# Altium schematic sheet [11]-NAD.SchDoc: S32K1_CONTROLLER
size A3; SheetNumber: 11; SheetTotal: 11
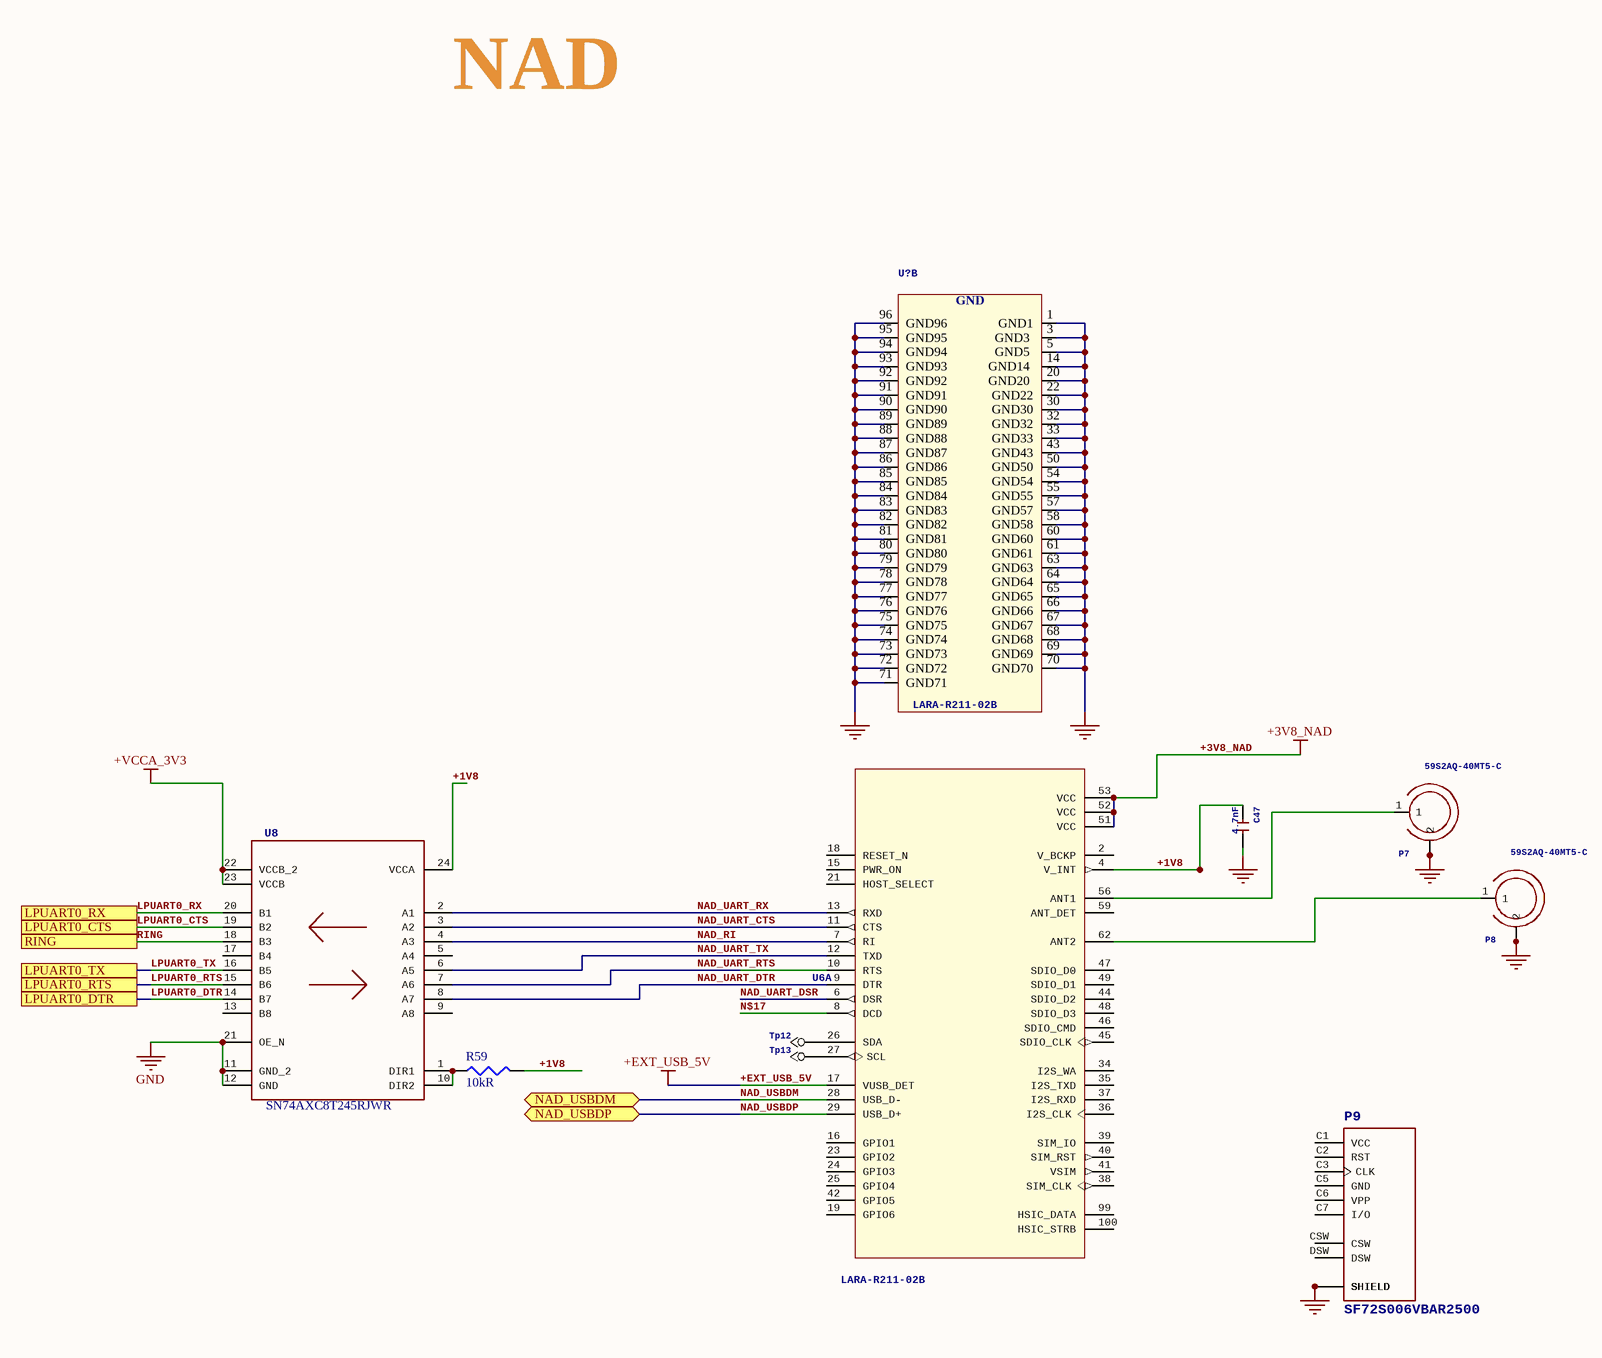
[diagram p0: [11]-NAD.SchDoc]

## Parts
C47  4.7nF  [C0402]
P7  59S2AQ-40MT5-C  [59S2AQ-40MT5-C]
P8  59S2AQ-40MT5-C  [59S2AQ-40MT5-C]
P9  SF72S006VBAR2500  [SF72S006VBAR2500_JAE_SF72S006VBAR2500]
R59  Resistance: 10kR  [RES0402]  (hidden comment: ERJ-2GEJ103X)
Tp12  TP  [TestPoint]  (value not drawn)
Tp13  TP  [TestPoint]  (value not drawn)
U6  LARA-R211-02B  [UBLOX_LARA-R211-02B]  (part A of 2)
U8  Value  [RJW0024A]  (value not drawn)
U?  LARA-R211-02B  [UBLOX_LARA-R211-02B]  (part B of 2)

## Ports
LPUART0_CTS, LPUART0_DTR, LPUART0_RTS, LPUART0_RX, LPUART0_TX, NAD_USBDM (bidir), NAD_USBDP (bidir), RING

## Nets
+3V8_NAD: U6.51(VCC) U6.52(VCC) U6.53(VCC)
+EXT_USB_5V: U6.17(VUSB_DET)
+VCCA_3V3: U8.22(VCCB_2) U8.23(VCCB)
GND: C47.2 P7.2_3_4_5_6_7_8_9(2) P7.3 P7.4 P7.5 P7.6 P7.7 P7.8 P8.2_3_4_5_6_7_8_9(2) P8.3 P8.4 P8.5 P8.6 P8.7 P8.8 P9.G1(SHIELD) P9.G2(SHIELD) P9.G3(SHIELD) P9.G4(SHIELD) P9.G5(SHIELD) P9.G6(SHIELD) P9.G7(SHIELD) P9.G8(SHIELD) P9.G9(SHIELD) P9.G10(SHIELD) U8.11(GND_2) U8.12(GND) U8.21(OE_N) U?.1(GND1) U?.3(GND3) U?.5(GND5) U?.14(GND14) U?.20(GND20) U?.22(GND22) U?.30(GND30) U?.32(GND32) U?.33(GND33) U?.43(GND43) U?.50(GND50) U?.54(GND54) U?.55(GND55) U?.57(GND57) U?.58(GND58) U?.60(GND60) U?.61(GND61) U?.63(GND63) U?.64(GND64) U?.65(GND65) U?.66(GND66) U?.67(GND67) U?.68(GND68) U?.69(GND69) U?.70(GND70) U?.71(GND71) U?.72(GND72) U?.73(GND73) U?.74(GND74) U?.75(GND75) U?.76(GND76) U?.77(GND77) U?.78(GND78) U?.79(GND79) U?.80(GND80) U?.81(GND81) U?.82(GND82) U?.83(GND83) U?.84(GND84) U?.85(GND85) U?.86(GND86) U?.87(GND87) U?.88(GND88) U?.89(GND89) U?.90(GND90) U?.91(GND91) U?.92(GND92) U?.93(GND93) U?.94(GND94) U?.95(GND95) U?.96(GND96)
+1V8: C47.1 R59.2 U6.4(V_INT) U8.24(VCCA)
LPUART0_CTS: U8.19(B2) ; port LPUART0_CTS
LPUART0_DTR: U8.14(B7) ; port LPUART0_DTR
LPUART0_RTS: U8.15(B6) ; port LPUART0_RTS
LPUART0_RX: U8.20(B1) ; port LPUART0_RX
LPUART0_TX: U8.16(B5) ; port LPUART0_TX
N$17: U6.8(DCD)
NAD_RI: U6.7(RI) U8.4(A3)
NAD_UART_CTS: U6.11(CTS) U8.3(A2)
NAD_UART_DSR: U6.6(DSR)
NAD_UART_DTR: U6.9(DTR) U8.8(A7)
NAD_UART_RTS: U6.10(RTS) U8.7(A6)
NAD_UART_RX: U6.13(RXD) U8.2(A1)
NAD_UART_TX: U6.12(TXD) U8.6(A5)
NAD_USBDM: U6.28(USB_D-) ; port NAD_USBDM
NAD_USBDP: U6.29(USB_D+) ; port NAD_USBDP
RING: U8.18(B3) ; port RING
NetP7_1: P7.1 U6.56(ANT1)
NetP8_1: P8.1 U6.62(ANT2)
NetR59_1: R59.1 U8.1(DIR1) U8.10(DIR2)
NetTp12_1: Tp12.1 U6.26(SDA)
NetTp13_1: Tp13.1 U6.27(SCL)

Not connected (* = marked no-connect by the designer): P9 C1(VCC) C2(RST) C3(CLK) C5(GND) C6(VPP) C7(I/O) CSW DSW; U6 2(V_BCKP) 15(PWR_ON) 16(GPIO1) 18(RESET_N) 19(GPIO6) 21(HOST_SELECT) 23(GPIO2) 24(GPIO3) 25(GPIO4) 34(I2S_WA) 35(I2S_TXD) 36(I2S_CLK) 37(I2S_RXD) 38(SIM_CLK) 39(SIM_IO) 40(SIM_RST) 41(VSIM) 42(GPIO5) 44(SDIO_D2) 45(SDIO_CLK) 46(SDIO_CMD) 47(SDIO_D0) 48(SDIO_D3) 49(SDIO_D1) 59(ANT_DET) 99(HSIC_DATA) 100(HSIC_STRB); U8 5(A4) 9(A8) 13(B8) 17(B4)

## Notes on the sheet
- NAD
- Title
- Size:
- Date:
- A3
- Number:
- Time:
- Revision:
- Sheet
- of
- File:
- (in symbol LARA-R211-02B, part B) GND

## Library data of the parts
C47 = CERAMIC-1NF-50V-10%-X7R(0402): 302010005; MPN: CC0402KRX7R9BB102; GateName_1: G$1; SymbolName_1: C; LibraryName: Seeed-Capacitor; DeviceSetName: CERAMIC-1NF-50V-10%-X7R(0402)
P7 P8 = 59S2AQ-40MT5-C: GateName_1: A; SymbolName_1: 59S2AQ-40MT5-C; LibraryName: WeOnReferencePlatform; DeviceSetName: 59S2AQ-40MT5-C
P9 = SF72S006VBAR2500: SF72 series, nano-SIM card connector, normail open type, 6 connector; GateName_1: G$1; MF: JAE Electronics; SymbolName_1: SF72S006VBAR2500; LibraryName: SF72S006VBAR2500; DeviceSetName: SF72S006VBAR2500; AVAILABILITY: Unavailable; MP: SF72S006VBAR2500; PACKAGE: None; PRICE: None
R59 = ERJ-2GEJ103X: Res Thick Film 0402 10K Ohm 5% 1/10W ±200ppm/°C Molded SMD SMD Punched Carrier T/R; Manufacturer: Panasonic; Power Rating: 100mW; Voltage Rating: 50V; Supplier 1: Digi-Key; Manufacturer Part Number: ERJ-2GEJ103X; Stock 1: 15334974; Pricing 1: 1 = 0.10000, 10 = 0.03100, 100 = 0.01250, 1000 = 0.00560, 2500 = 0.00486, 5000 = 0.00401 (USD); Mount: Surface Mount; Case/Package: 0402; Case Code (Metric): 1005; Case Code (Imperial): 0402; Contact Plating: Tin; Min Operating Temperature: -55°C; Max Operating Temperature: 155°C; Packaging: Cut Tape; Tolerance: 5%; Package Quantity: 1; Composition: Thick Film; Number of Terminations: 2; Termination: SMD/SMT; Military Standard: Not; Temperature Coefficient: 200ppm/°C; Max Power Dissipation: 100mW; Voltage Rating (DC): 50V; Features: Automotive AEC-Q200; Length: 1mm; Height: 0.35mm; Width: 0.02inch; Depth: 0.5mm; Radiation Hardening: No; REACH SVHC: No SVHC; Lead Free: Lead Free; ComponentLink1URL: http://industrial.panasonic.com/www-data/pdf/AOA0000/AOA0000CE1.pdf?src-supplier=Avnet+Europe; ComponentLink1Description: http://industrial.panasonic.com/www-data/pdf/AOA0000/AOA0000CE1.pdf?src-supplier=Avnet+Europe; ComponentLink2URL: http://www.farnell.com/datasheets/1678796.pdf?src-supplier=Element14; ComponentLink2Description: http://www.farnell.com/datasheets/1678796.pdf?src-supplier=Element14; ComponentLink3URL: http://www.mouser.com/ds/2/315/AOA0000CE1-37422.pdf?src-supplier=Mouser; ComponentLink3Description: http://www.mouser.com/ds/2/315/AOA0000CE1-37422.pdf?src-supplier=Mouser; ComponentLink4URL: http://www.farnell.com/datasheets/2059623.pdf?src-supplier=Farnell; ComponentLink4Description: http://www.farnell.com/datasheets/2059623.pdf?src-supplier=Farnell; ComponentLink5URL: https://www.alliedelec.com/m/d/51cd0790071e1666bdb9d00c57fcf960.pdf?src-supplier=Allied+Electronics; ComponentLink5Description: https://www.alliedelec.com/m/d/51cd0790071e1666bdb9d00c57fcf960.pdf?src-supplier=Allied+Electronics; ComponentLink6URL: http://www.jameco.com/Jameco/Products/ProdDS/1935721.pdf?src-supplier=Jameco; ComponentLink6Description: http://www.jameco.com/Jameco/Products/ProdDS/1935721.pdf?src-supplier=Jameco; ComponentLink7URL: http://industrial.panasonic.com/www-data/pdf/AOA0000/AOA0000CE1.pdf?src-supplier=Avnet; ComponentLink7Description: http://industrial.panasonic.com/www-data/pdf/AOA0000/AOA0000CE1.pdf?src-supplier=Avnet; ComponentLink8URL: http://datasheet.octopart.com/ERJ-2GEJ103X-Panasonic-datasheet-13266872.pdf?src-supplier=Newark; ComponentLink8Description: http://datasheet.octopart.com/ERJ-2GEJ103X-Panasonic-datasheet-13266872.pdf?src-supplier=Newark; ComponentLink9URL: http://datasheet.octopart.com/ERJ-2GEJ103X-Panasonic-datasheet-61114972.pdf?src-supplier=Farnell; ComponentLink9Description: http://datasheet.octopart.com/ERJ-2GEJ103X-Panasonic-datasheet-61114972.pdf?src-supplier=Farnell; ComponentLink10URL: http://datasheet.octopart.com/ERJ-2GEJ103X-Panasonic-datasheet-5314550.pdf?src-supplier=Element14; ComponentLink10Description: http://datasheet.octopart.com/ERJ-2GEJ103X-Panasonic-datasheet-5314550.pdf?src-supplier=Element14; ComponentLink11URL: http://datasheet.octopart.com/ERJ-2GEJ103X-Panasonic-datasheet-78375410.pdf; ComponentLink11Description: http://datasheet.octopart.com/ERJ-2GEJ103X-Panasonic-datasheet-78375410.pdf; ComponentLink12URL: http://datasheet.octopart.com/ERJ-2GEJ103X-Panasonic-datasheet-17720667.pdf?src-supplier=Jameco; ComponentLink12Description: http://datasheet.octopart.com/ERJ-2GEJ103X-Panasonic-datasheet-17720667.pdf?src-supplier=Jameco; ComponentLink13URL: http://datasheet.octopart.com/ERJ-2GEJ103X-Panasonic-datasheet-37173568.pdf?src-supplier=Electro+Sonic; ComponentLink13Description: http://datasheet.octopart.com/ERJ-2GEJ103X-Panasonic-datasheet-37173568.pdf?src-supplier=Electro+Sonic; ComponentLink14URL: http://datasheet.octopart.com/ERJ-2GEJ103X-Panasonic-datasheet-118598.pdf?src-supplier=Digi-Key; ComponentLink14Description: http://datasheet.octopart.com/ERJ-2GEJ103X-Panasonic-datasheet-118598.pdf?src-supplier=Digi-Key; ComponentLink15URL: http://datasheet.octopart.com/ERJ-2GEJ103X-Panasonic-datasheet-5313456.pdf?src-supplier=Farnell; ComponentLink15Description: http://datasheet.octopart.com/ERJ-2GEJ103X-Panasonic-datasheet-5313456.pdf?src-supplier=Farnell; ComponentLink16URL: http://datasheet.octopart.com/ERJ-2GEJ103X-Panasonic-datasheet-10554283.pdf?src-supplier=Farnell; ComponentLink16Description: http://datasheet.octopart.com/ERJ-2GEJ103X-Panasonic-datasheet-10554283.pdf?src-supplier=Farnell; ComponentLink17URL: http://datasheet.octopart.com/ERJ-2GEJ103X-Panasonic-datasheet-11480398.pdf?src-supplier=Arrow; ComponentLink17Description: http://datasheet.octopart.com/ERJ-2GEJ103X-Panasonic-datasheet-11480398.pdf?src-supplier=Arrow; ComponentLink18URL: http://datasheet.octopart.com/ERJ-2GEJ103X-Panasonic---ECG-datasheet-15994758.pdf?src-supplier=Farnell; ComponentLink18Description: http://datasheet.octopart.com/ERJ-2GEJ103X-Panasonic---ECG-datasheet-15994758.pdf?src-supplier=Farnell; ComponentLink19URL: http://datasheet.octopart.com/ERJ2GEJ103X-Panasonic-datasheet-27908757.pdf?src-supplier=Electro+Sonic; ComponentLink19Description: http://datasheet.octopart.com/ERJ2GEJ103X-Panasonic-datasheet-27908757.pdf?src-supplier=Electro+Sonic; ComponentLink20URL: http://datasheet.octopart.com/Thick-Film-Chip-Resistors-Panasonic-datasheet-family-105.pdf; ComponentLink20Description: http://datasheet.octopart.com/Thick-Film-Chip-Resistors-Panasonic-datasheet-family-105.pdf; Supplier Part Number 1: P10KJCT-ND
Tp12 Tp13 = TP: GateName_1: G$1; TP?: >TP_NAME; SymbolName_1: TP; LibraryName: WeOnReferencePlatform; DeviceSetName: TP
U6 U? = LARA-R211-02B: The LARA-R2 series comprises LTE Cat 1 / 3G / 2G multi-mode modules in the very small LARA LGA form-factor (26.0 x 24.0 mm, 100-pin) that are easy to integrate in compact designs.; GateName_1: G$1; MF: U-Blox America Inc.; SymbolName_1: LARA-R211-02B; LibraryName: LARA-R211-02B; DeviceSetName: LARA-R211-02B; AVAILABILITY: Unavailable; MP: LARA-R211-02B; PACKAGE: Package Analog Devices; PRICE: None
U8 = SN74AXC8T245RJWR: MANUFACTURER: Texas Instruments; GateName_1: A; SymbolName_1: SN74AXC8T245RJW; LibraryName: WeOnReferencePlatform; DeviceSetName: SN74AXC8T245RJWR; PARTNUMBER: SN74AXC8T245RJWR; REFDES: RefDes; TYPE: TYPE